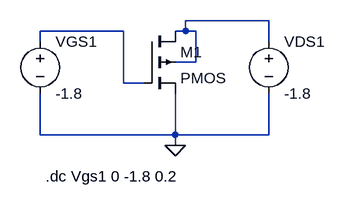
[diagram p0: schematic pmos_180.asc]
pmos_180.asc, the LTspice schematic file:
Version 4.1
SHEET 1 880 680
WIRE 352 80 224 80
WIRE 128 96 0 96
WIRE 224 96 224 80
WIRE 224 96 208 96
WIRE 240 96 224 96
WIRE 0 112 0 96
WIRE 352 112 352 80
WIRE 240 144 240 96
WIRE 240 144 208 144
WIRE 128 176 128 96
WIRE 160 176 128 176
WIRE 0 256 0 192
WIRE 208 256 208 192
WIRE 208 256 0 256
WIRE 352 256 352 192
WIRE 352 256 208 256
WIRE 208 272 208 256
FLAG 208 272 0
SYMBOL pmos4 160 96 R0
SYMATTR InstName M1
SYMATTR Value2 l=180n w=810n
SYMBOL voltage 0 96 R0
SYMATTR InstName VGS1
SYMATTR Value -1.8
SYMBOL voltage 352 96 R0
SYMATTR InstName VDS1
SYMATTR Value -1.8
TEXT 8 320 Left 2 !.dc Vgs1 0 -1.8 0.2

The netlist it stands for:
* pmos_180.asc
M1 N001 N002 0 N001 PMOS l=180n w=810n
VGS1 N002 0 -1.8
VDS1 N001 0 -1.8
.model NMOS NMOS
.model PMOS PMOS
.lib standard.mos
.dc Vgs1 0 -1.8 0.2
.backanno
.end